# EAGLE design Retro_Programmer-v0.2 (EAGLE 7.3.0)
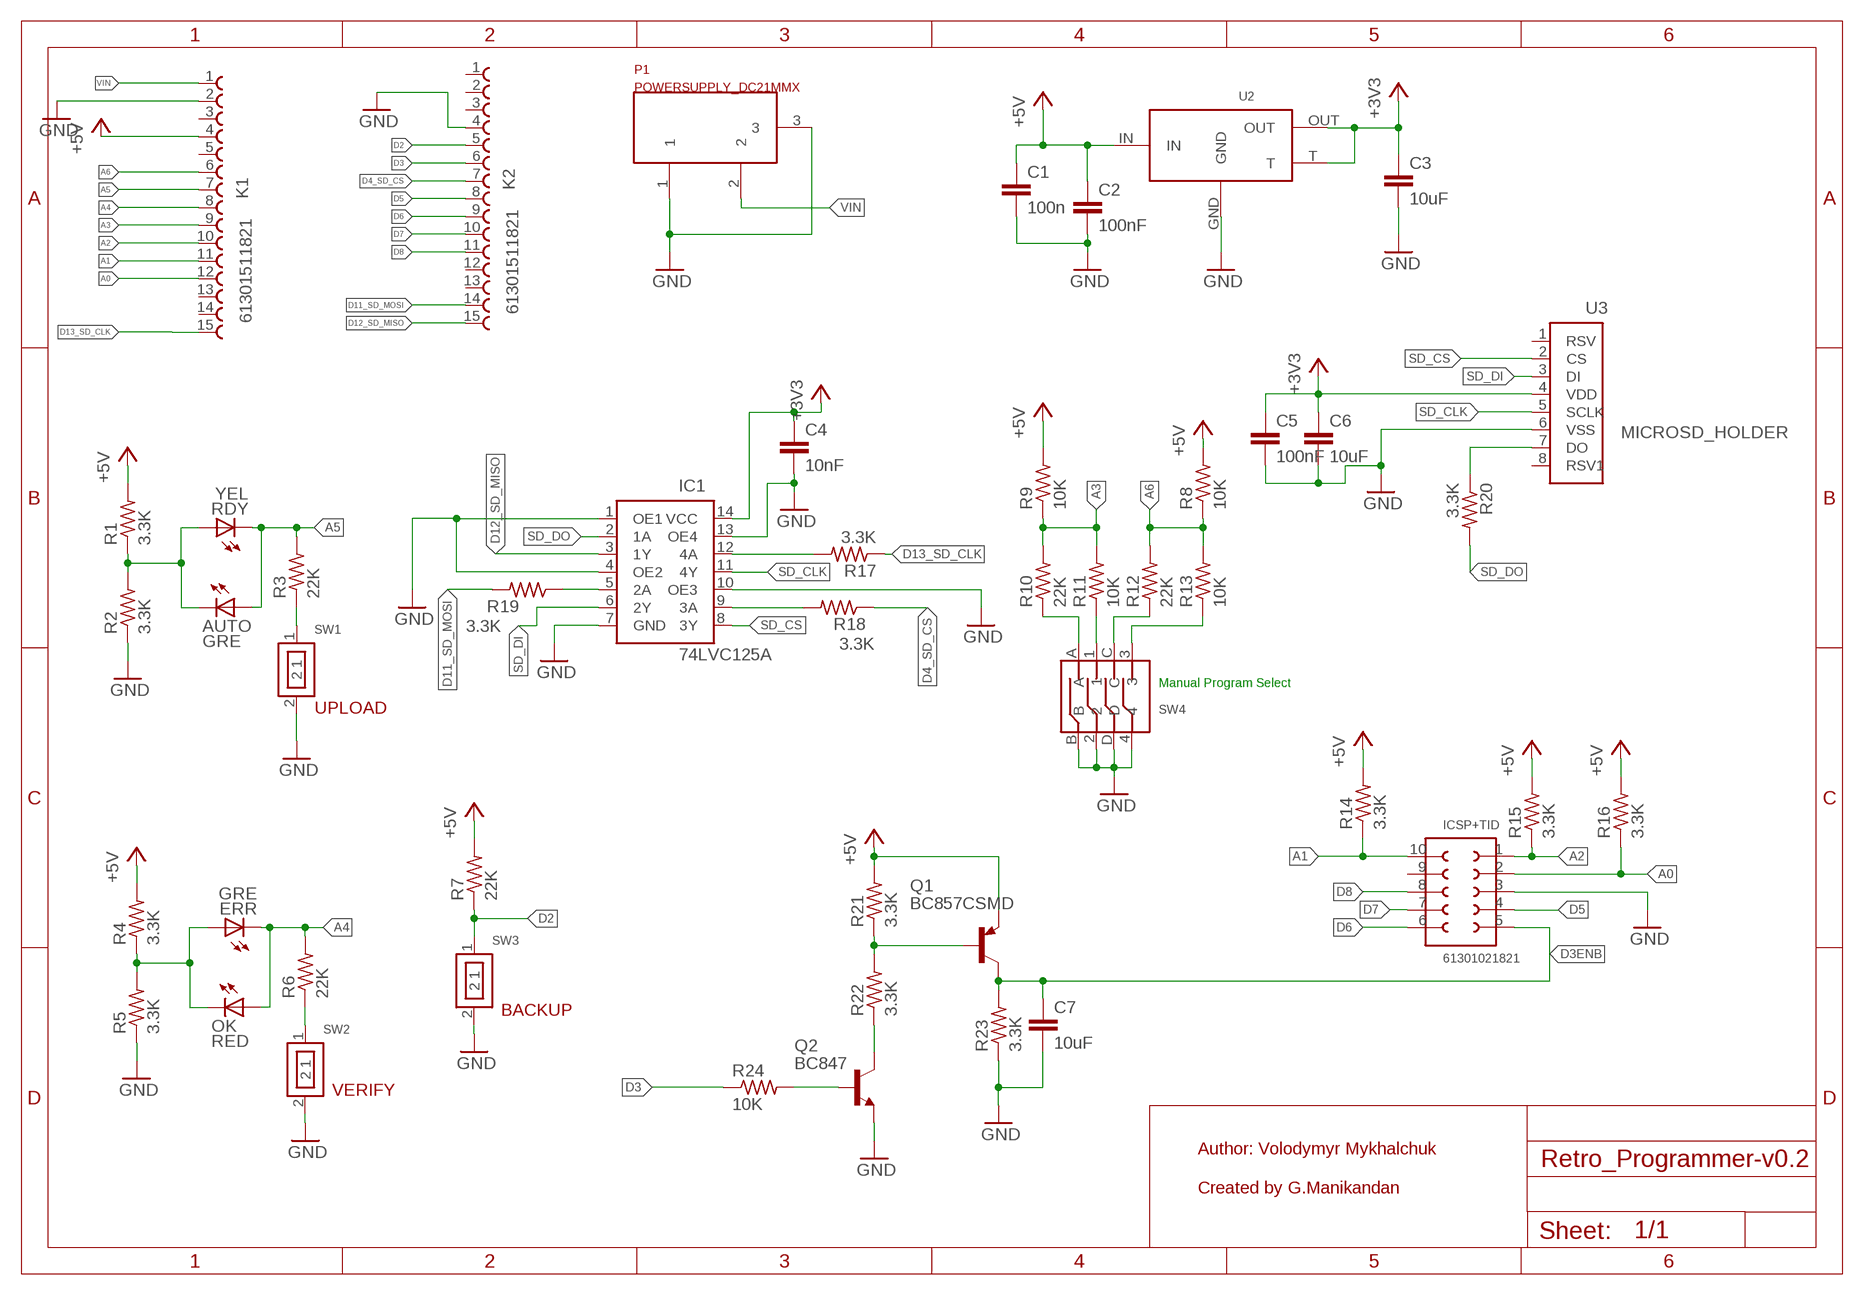
[diagram p0: schematic, sheet 1]

## Parts
AUTO  GRE  LEDCHIPLED_1206  [CHIPLED_1206]
C1  100n  C-EUC1206  [C1206]
C2  100nF  C-EUC1206  [C1206]
C3  10uF  C-EUC1206  [C1206]
C4  10nF  C-EUC1206  [C1206]
C5  100nF  C-EUC1206  [C1206]
C6  10uF  C-EUC1206  [C1206]
C7  10uF  C-EUC1206  [C1206]
ERR  GRE  LEDCHIPLED_1206  [CHIPLED_1206]
IC1  74LVC125A  [SOIC14_74L]
ICSP+TID  61301021821  [61301021821]
K1  61301511821  [61301511821]
K2  61301511821  [61301511821]
OK  RED  LEDCHIPLED_1206  [CHIPLED_1206]
P1  POWERSUPPLY_DC21MMX  [POWERSUPPLY_DC-21MM]
Q1  BC857CSMD  [SOT23-BEC]
Q2  BC847  [SOT23]
R1  3.3K  R-US_R1206  [R1206]
R2  3.3K  R-US_R1206  [R1206]
R3  22K  R-US_R1206  [R1206]
R4  3.3K  R-US_R1206  [R1206]
R5  3.3K  R-US_R1206  [R1206]
R6  22K  R-US_R1206  [R1206]
R7  22K  R-US_R1206  [R1206]
R8  10K  R-US_R1206  [R1206]
R9  10K  R-US_R1206  [R1206]
R10  22K  R-US_R1206  [R1206]
R11  10K  R-US_R1206  [R1206]
R12  22K  R-US_R1206  [R1206]
R13  10K  R-US_R1206  [R1206]
R14  3.3K  R-US_R1206  [R1206]
R15  3.3K  R-US_R1206  [R1206]
R16  3.3K  R-US_R1206  [R1206]
R17  3.3K  R-US_R1206  [R1206]
R18  3.3K  R-US_R1206  [R1206]
R19  3.3K  R-US_R1206  [R1206]
R20  3.3K  R-US_R1206  [R1206]
R21  3.3K  R-US_R1206  [R1206]
R22  3.3K  R-US_R1206  [R1206]
R23  3.3K  R-US_R1206  [R1206]
R24  10K  R-US_R1206  [R1206]
RDY  YEL  LEDCHIPLED_1206  [CHIPLED_1206]
SW1  SPUSH  [SLIDE1]
SW2  SPUSH  [SLIDE1]
SW3  SPUSH  [SLIDE1]
SW4  SLIDE_WAY4  [SLIDESWITCH_4]
U2  LT1117  [SOT223]
U3  MICROSD_HOLDER  [SDCARD_HOLDER]

## Nets
+3V3: C3.1 C4.1 C5.1 C6.1 IC1.14(VCC) U2.OUT U2.T U3.4(VDD)
+5V: C1.1 C2.1 K1.4 Q1.E R1.2 R4.2 R7.2 R8.2 R9.2 R14.2 R15.2 R16.2 R21.2 U2.IN
A0: ICSP+TID.2 K1.12 R16.1
A1: ICSP+TID.10 K1.11 R14.1
A2: ICSP+TID.1 K1.10 R15.1
A3: K1.9 R9.1 R10.2 R11.2
A4: ERR.C K1.8 OK.A R6.2
A5: AUTO.A K1.7 R3.2 RDY.C
A6: K1.6 R8.1 R12.2 R13.2
D2: K2.5 R7.1 SW3.1
D3: K2.6 R24.1
D3ENB: C7.1 ICSP+TID.5 Q1.C R23.2
D4_SD_CS: K2.7 R18.1
D5: ICSP+TID.4 K2.8
D6: ICSP+TID.6 K2.9
D7: ICSP+TID.7 K2.10
D8: ICSP+TID.8 K2.11
D11_SD_MOSI: K2.14 R19.2
D12_SD_MISO: IC1.3(1Y) K2.15
D13_SD_CLK: K1.15 R17.1
GND: C1.2 C2.2 C3.2 C4.2 C5.2 C6.2 C7.2 IC1.1(OE1) IC1.4(OE2) IC1.7(GND) IC1.10(OE3) IC1.13(OE4) ICSP+TID.3 K1.2 K2.4 P1.1 P1.3 Q2.2(E) R2.1 R5.1 R23.1 SW1.2 SW2.2 SW3.2 SW4.2 SW4.4 SW4.B SW4.D U2.GND U3.6(VSS)
N$1: AUTO.C R1.1 R2.2 RDY.A
N$2: R3.1 SW1.1
N$3: ERR.A OK.C R4.1 R5.2
N$4: R6.1 SW2.1
N$5: R10.1 SW4.A
N$6: R11.1 SW4.1
N$7: R12.1 SW4.C
N$8: R13.1 SW4.3
N$9: Q1.B R21.1 R22.2
N$10: R20.1 U3.7(DO)
N$11: Q2.3(C) R22.1
N$12: IC1.12(4A) R17.2
N$13: IC1.9(3A) R18.2
N$15: Q2.1(B) R24.2
N$17: IC1.5(2A) R19.1
SD_CLK: IC1.11(4Y) U3.5(SCLK)
SD_CS: IC1.8(3Y) U3.2(CS)
SD_DI: IC1.6(2Y) U3.3(DI)
SD_DO: IC1.2(1A) R20.2
VIN: K1.1 P1.2
Unconnected: ICSP+TID.9 K1.3 K1.5 K1.13 K1.14 K2.1 K2.2 K2.3 K2.12 K2.13 U3.1(RSV) U3.8(RSV1)

## Notes on the sheet
- U2
- Manual Program Select
- UPLOAD
- BACKUP
- VERIFY
- Author: Volodymyr Mykhalchuk
- Created by G.Manikandan

## Library data of the parts
AUTO ERR OK RDY = led:LED: LED OSRAM: - CHIPLED LG R971, LG N971, LY N971, LG Q971, LY Q971, LO R971, LY R971 LH N974, LH R974 LS Q976, LO Q976, LY Q976 LO Q996 - Hyper CHIPLED LW Q18S LB Q993, LB Q99A, LB R99A - SideLED LS A670, LO A670, LY A670, LG A670, LP A670 LB A673, LV A673, LT A673, LW A673 LH A674 LY A675 LS A676, LA A676, LO A676, LY A676, LW A676 LS A679, LY A679, LG A679 - Hyper Micro SIDELED® LS Y876, LA Y876, LO Y876, LY Y876 LT Y87S - SmartLED LW L88C, LW L88S LB L89C, LB L89S, LG L890 LS L89K, LO L89K, LY L89K LS L896, LA L896, LO L896, LY L896 - TOPLED LS T670, LO T670, LY T670, LG T670, LP T670 LSG T670, LSP T670, LSY T670, LOP T670, LYG T670 LG T671, LOG T671, LSG T671 LB T673, LV T673, LT T673, LW T673 LH T674 LS T676, LA T676, LO T676, LY T676, LB T676, LH T676, LSB T676, LW T676 LB T67C, LV T67C, LT T67C, LS T67K, LO T67K, LY T67K, LW E67C LS E67B, LA E67B, LO E67B, LY E67B, LB E67C, LV E67C, LT E67C LW T67C LS T679, LY T679, LG T679 LS T770, LO T770, LY T770, LG T770, LP T770 LB T773, LV T773, LT T773, LW T773 LH T774 LS E675, LA E675, LY E675, LS T675 LS T776, LA T776, LO T776, LY T776, LB T776 LHGB T686 LT T68C, LB T68C - Hyper Mini TOPLED® LB M676 - Mini TOPLED Santana® LG M470 LS M47K, LO M47K, LY M47K Source: http://www.osram.convergy.de LUXEON: - LUMILED® LXK2-PW12-R00, LXK2-PW12-S00, LXK2-PW14-U00, LXK2-PW14-V00 LXK2-PM12-R00, LXK2-PM12-S00, LXK2-PM14-U00 LXK2-PE12-Q00, LXK2-PE12-R00, LXK2-PE12-S00, LXK2-PE14-T00, LXK2-PE14-U00 LXK2-PB12-K00, LXK2-PB12-L00, LXK2-PB12-M00, LXK2-PB14-N00, LXK2-PB14-P00, LXK2-PB14-Q00 LXK2-PR12-L00, LXK2-PR12-M00, LXK2-PR14-Q00, LXK2-PR14-R00 LXK2-PD12-Q00, LXK2-PD12-R00, LXK2-PD12-S00 LXK2-PH12-R00, LXK2-PH12-S00 LXK2-PL12-P00, LXK2-PL12-Q00, LXK2-PL12-R00 Source: www.luxeon.com KINGBRIGHT: KA-3528ASYC Source: www.kingbright.com
C1-C7 = rcl:C-EU: CAPACITOR, European symbol
IC1 = Ard:74LVC125A
ICSP+TID = Wuerth_Elektronik_Board_to_Board:61301021821: WR-PHD 2.54mm Dual Socket Header, 10 Pins =>Code : Con_BTB_SHD_2.54_2_61301021821 <http://katalog.we-online.de/media/images/eican/Con_BTB_SHD_2.54_2_6130xx21821_pf2.jpg> Details see: http://katalog.we-online.de/en/em/613_0xx_218_21 Created 2014-05-29, Karrer Zheng 2014 (C) Würth Elektronik
K1 K2 = Wurth_Elektronik_Electromechanic_Board_to_Board_Connectors_rev15c:61301511821: WR-PHD 2.54mm Socket Header, 15 Pins =>Code : Con_BTB_SHD_2.54_1_THT_61301511821 <http://katalog.we-online.de/media/images/eican/Con_BTB_SHD_2.54_1_THT_6130xx11821_pf2.jpg> Details see: http://katalog.we-online.de/en/em/613_0xx_118_21 Created 2014-05-29, Karrer Zheng 2014 (C) Würth Elektronik
P1 = SmartPrj:POWERSUPPLY_DC21MM
Q1 = transistor-pnp:BC857*: PNP Transistror
Q2 = transistor:BC847: NPN TRANSISTOR
R1-R24 = rcl:R-US_: RESISTOR, American symbol
SW1-SW3 = Ard:SPUSH
SW4 = Ard:SLIDE_WAY4
U2 = linear-technology:LT1117
U3 = Ard:MICROSD_HOLDER

## Board
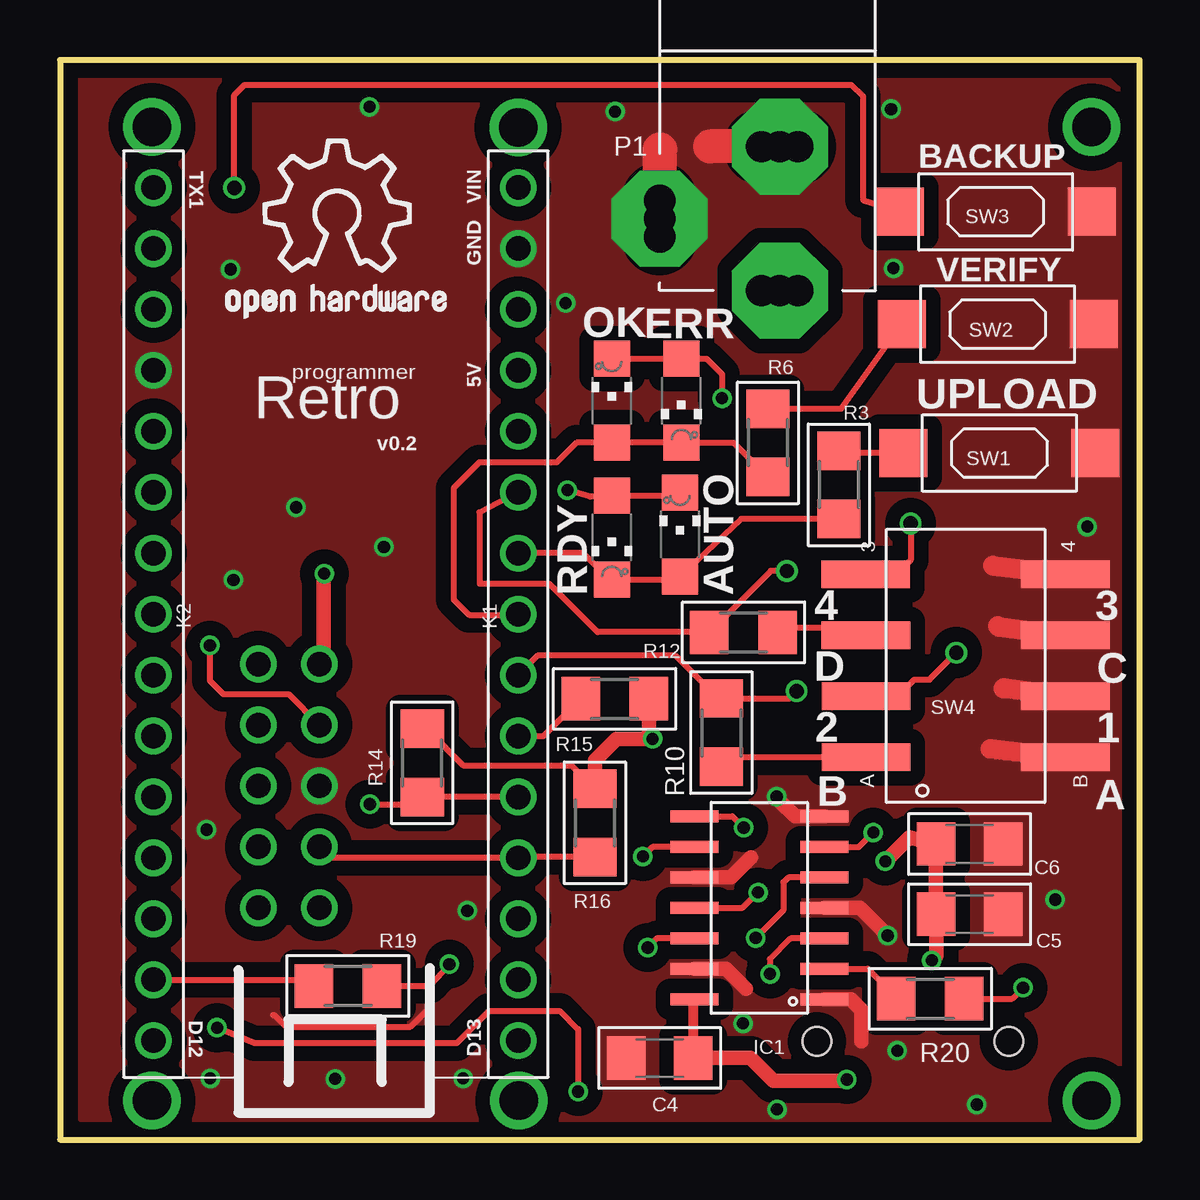
[diagram p1: board, top side]
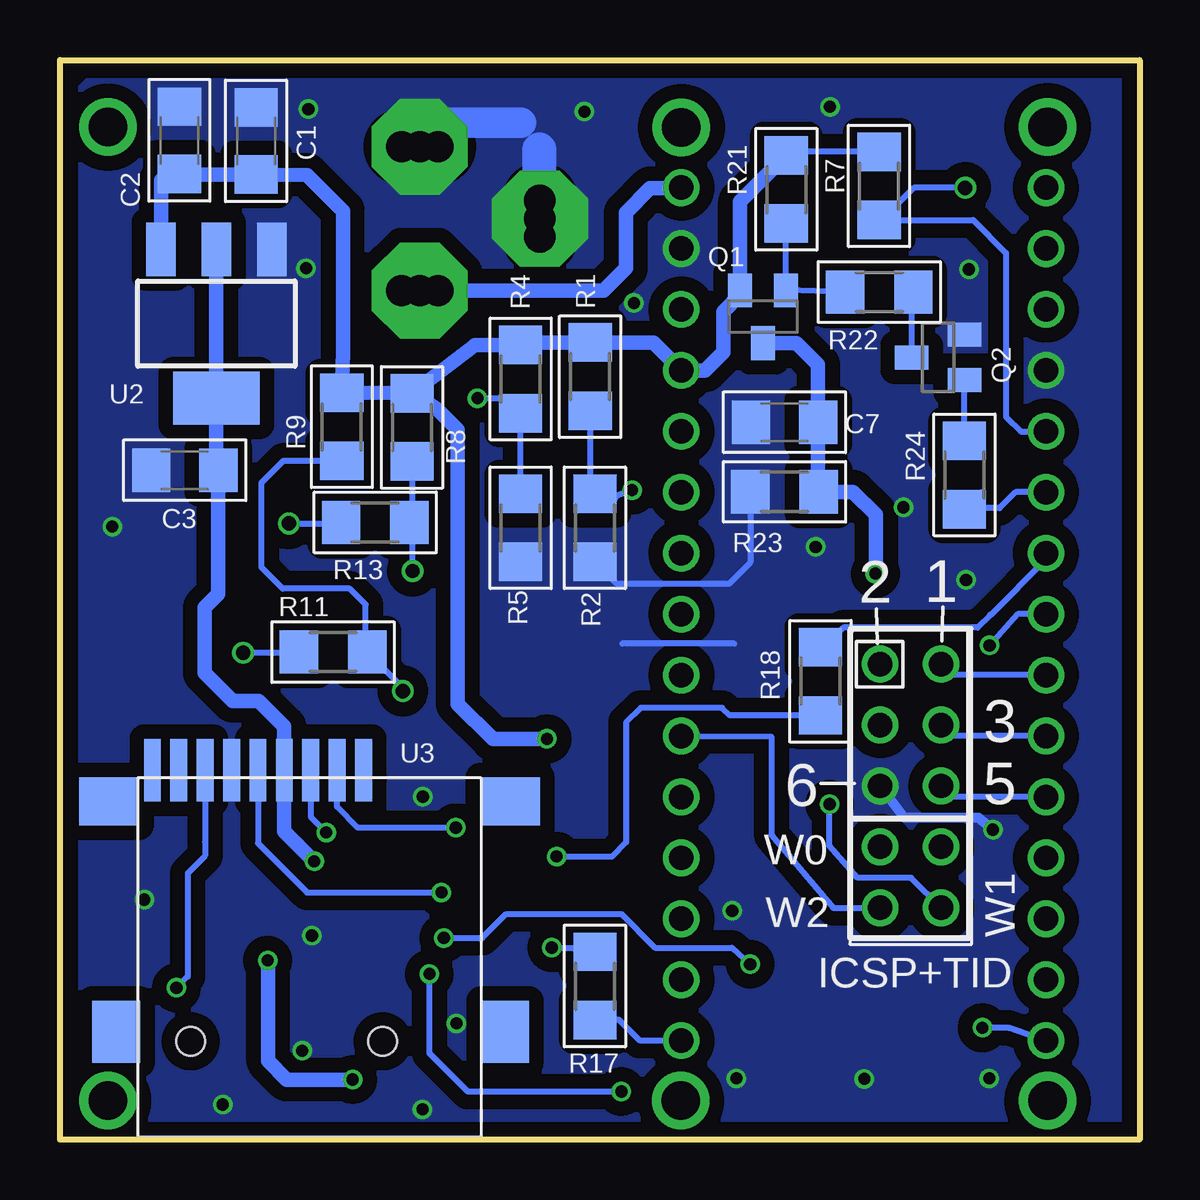
[diagram p2: board, bottom side, seen from below]

Size 45 x 45 mm. Coordinates in mm from the lower left corner, seen from the top.
Outline: 0,0 45,0 45,45 0,45 0,0
Copper layers (1*16): Top 0.035mm / dielectric 1.5mm / Bottom 0.035mm
Design rules "dirt_cheap_dirty_boards.v1": minimum track width 5mil, minimum drill 12mil, track to track 5mil, track to pad 5mil, pad to pad 5mil, via to via 5mil, smd to smd 0mil, copper to edge 10mil, drill to drill 10mil, minimum pad ring 10mil, minimum via ring 6mil, stop-mask expansion 2mil, vias tented up to drill 25mil, thermal gap 10mil

### Footprints (pad centres in the part's own frame; a part is rotated, then mirrored left to right if it is on the bottom)
CHIPLED_1206 = smd 1.5 x 1.5: A 0,-1.75; C 0,1.75
C1206 = smd 1.6 x 1.8: 1 -1.4,0; 2 1.4,0
SOIC14_74L = smd 2 x 0.5: 1 -2.7,3.81; 2 -2.7,2.54; 3 -2.7,1.27; 4 -2.7,0; 5 -2.7,-1.27; 6 -2.7,-2.54; 7 -2.7,-3.81; 8 2.7,-3.82; 9 2.7,-2.54; 10 2.7,-1.27; 11 2.7,0; 12 2.7,1.27; 13 2.7,2.54; 14 2.7,3.81
61301021821 = drill 1.02: 1 -5.08,1.27; 2 -2.54,1.27; 3 0,1.27; 4 2.54,1.27; 5 5.08,1.27; 6 5.08,-1.27; 7 2.54,-1.27; 8 0,-1.27; 9 -2.54,-1.27; 10 -5.08,-1.27
61301511821 = drill 1.02: 1 -17.78,0; 2 -15.24,0; 3 -12.7,0; 4 -10.16,0; 5 -7.62,0; 6 -5.08,0; 7 -2.54,0; 8 0,0; 9 2.54,0; 10 5.08,0; 11 7.62,0; 12 10.16,0; 13 12.7,0; 14 15.24,0; 15 17.78,0
POWERSUPPLY_DC-21MM = drill 1.3 pad 4 octagon: 1 -5.08,-3.353; 2 -0.076,-6.35; 3 -0.076,-0.356 | drill 1.3: 4 -5.08,-4.115; 5 -5.08,-2.591; 6 -0.838,-0.356; 7 0.686,-0.356; 8 -0.838,-6.35; 9 0.686,-6.35
SOT23-BEC = smd 1 x 1.4: B -0.95,-1.1; C 0,1.1; E 0.95,-1.1
SOT23 = smd 1 x 1.4: 1 -0.95,-1.1; 2 0.95,-1.1; 3 0,1.1
R1206 = smd 1.6 x 1.803: 1 -1.422,0; 2 1.422,0
SLIDE1 = smd 2 x 2: 1 0,4; 2 0,-4
SLIDESWITCH_4 = smd 1.15 x 3.7: 1 -1.27,4.15; 2 -1.27,-4.15; 3 3.81,4.17; 4 3.81,-4.15; A -3.81,4.15; B -3.81,-4.16; C 1.27,4.16; D 1.27,-4.16
SOT223 = smd 1.219 x 2.235: GND -2.311,-3.099; IN 2.311,-3.099; OUT 0,-3.099 | smd 3.6 x 2.2: T 0,3.099
SDCARD_HOLDER = smd 0.7 x 2.6: 1 3.2,7.8; 2 2.1,7.8; 3 1,7.8; 4 -0.1,7.8; 5 -1.2,7.8; 6 -2.3,7.8; 7 -3.4,7.8; 8 -4.5,7.8; 9 -5.6,7.8 | smd 2 x 2.6: P$1 -7.1,-3.1; P$2 9.1,-3.1 | smd 2.5 x 2: P$3 -7.4,6.5; P$4 9.3,6.5 | hole 1.2: -4,-3.5; 4,-3.5

### Placement (x,y rotation side)
AUTO  25.84,25.23 0 top
C1  36.83,41.63 90 bottom
C2  40.02,41.65 90 bottom
C3  39.8,27.9 180 bottom
C4  25,3.4 180 top
C5  37.92,9.39 0 top
C6  37.92,12.32 0 top
C7  14.8,29.9 180 bottom
ERR  25.9,30.8 180 top
IC1  29.16,9.66 180 top
ICSP+TID  9.54,14.74 90 bottom
K1  19.1,21.9 270 top
K2  3.9,21.9 270 top
OK  23,30.8 0 top
P1  30.08,41.74 0 top
Q1  15.7,34.3 180 bottom
Q2  8.4,32.6 90 bottom
R1  22.9,31.8 90 bottom
R2  22.7,25.5 90 bottom
R3  32.47,27.29 270 top
R4  25.8,31.7 90 bottom
R5  25.8,25.5 90 bottom
R6  29.51,29.04 270 top
R7  10.86,39.75 90 bottom
R8  30.32,29.69 90 bottom
R9  33.25,29.71 90 bottom
R10  27.57,16.96 90 top
R11  33.62,20.32 0 bottom
R12  28.49,21.14 180 top
R13  31.86,25.72 0 bottom
R14  15.1,15.7 90 top
R15  23.12,18.37 0 top
R16  22.3,13.2 90 top
R17  22.7,6.4 90 bottom
R18  13.3,19.1 270 bottom
R19  12,6.4 180 top
R20  36.27,5.87 180 top
R21  14.73,39.61 90 bottom
R22  10.85,35.32 180 bottom
R23  14.8,27 0 bottom
R24  7.3,27.7 90 bottom
RDY  23,25.1 180 top
SW1  39.16,28.61 90 top
SW2  39.08,33.99 90 top
SW3  39.01,38.67 90 top
SW4  37.75,19.74 90 top
U2  38.48,34.01 180 bottom
U3  35.55,7.59 0 bottom

### Tracks (layer width: path | path; a pad name or v marks a point on that pad's centre or on a via)
115  (via drill 1.6)
  other vias: 19.13,1.62
+3V3  (via drill 0.51)
  Top 0.406: IC1.14 26.4,5.79 C4.1
  Top 0.61: v34.4,11.6 35.4,12.6 C6.1 C5.1 36.54,7.67 v36.34,7.47 | C4.1 28.78,3.4 29.74,2.44 32.74,2.44 v32.8,2.5
  Bottom 0.254: U2.T 38.48,30.48 38.4,30.4 38.4,30.83 U2.T
  Bottom 0.61: U2.OUT U2.T 38.48,27.98 C3.1 38.4,22.74 38.96,22.17 38.96,19.46 37.8,18.29 36.73,18.29 35.65,17.21 U3.4 35.65,12.85 v34.4,11.6 | v32.8,2.5 35.55,2.5 36.32,3.28 36.32,7.45 v36.34,7.47
+5V  (via drill 0.51)
  Top 0.254: R14.2 15.28,17.12 15.28,17.02 15.38,17.02 16.8,15.6 21.32,15.6 R16.2
  Top 0.61: 24.72,16.72 v24.7,16.7 | R16.2 22.3,15.8 23.19,16.69 24.69,16.69 v24.7,16.7 | R15.2 24.54,16.86 v24.7,16.7
  Bottom 0.254: 40.7,37.02 U2.IN | R7.2 14.58,41.17 R21.2
  Bottom 0.61: R8.2 27.7,33.12 R4.2 25.7,33.22 R1.2 20.26,33.22 K1.4 18.11,32.06 17.35,32.82 17.35,34.52 16.65,35.22 Q1.E 16.65,39.1 R21.2 | R8.2 R9.2 33.2,32.8 33.2,38.7 34.7,40.2 C1.1 40.5,40.23 C2.1 40.79,39.99 U2.IN | R8.2 29.25,30.42 28.42,29.59 28.42,18.16 26.95,16.69 24.71,16.69 v24.7,16.7 24.74,16.66
A0
  Top 0.254: R16.1 19.14,11.78 K1.12 11.27,11.74 ICSP+TID.2
A1  (via drill 0.51)
  Top 0.254: v12.92,13.98 14.8,13.98 R14.1 K1.11
  Bottom 0.254: ICSP+TID.10 9.53,10.91 11.75,10.91 12.93,12.24 v12.92,13.98
A2
  Top 0.254: K1.10 20.15,16.82 R15.1
  Bottom 0.254: K1.10 15.35,16.8 15.35,12.71 12.75,9.65 ICSP+TID.1
A3  (via drill 0.6)
  Top 0.254: v30.71,18.69 30.4,18.38 R10.2 27.44,18.38 25.65,20.17 19.91,20.17 K1.9
  Bottom 0.254: v30.71,18.69 30.71,18.83 R11.2 32.26,20.38 32.26,22.3 32.92,22.96 35.71,22.96 36.6,23.85 36.6,27.38 35.69,28.3 R9.1
A4
  Top 0.254: R6.2 28.08,29.05 ERR.C OK.A 21.53,29.05 20.7,28.22 17.48,28.22 16.41,27.15 16.41,22.5 17.04,21.87 19.07,21.87 K1.8
A5
  Top 0.254: R3.2 28.39,25.87 AUTO.A 25.87,23.35 RDY.C 22.95,23.3 21.81,24.44 K1.7
A6  (via drill 0.6)
  Top 0.254: K1.6 17.48,26.14 17.5,26.11 17.5,23.16 20.4,23.16 22.41,21.15 27.04,21.15 R12.2 29.63,23.7 v30.3,23.7
  Bottom 0.254: R8.1 30.32,25.48 R13.2 30.3,25.59 v30.3,23.7
D2  (via drill 0.6)
  Top 0.254: v7.26,39.67 7.26,43.54 7.7,43.97 32.97,43.97 33.48,43.48 33.48,39.16 SW3.1
  Bottom 0.254: R7.1 6.93,38.33 5.56,36.96 5.56,30.12 4.95,29.52 K2.5 | R7.1 10.11,38.33 | v7.26,39.67 9.4,39.67 10.24,38.84 10.35,38.84 R7.1
D3
  Bottom 0.254: 6.6,26.98 6.9,26.68 | 6.9,26.68 R24.1 | K2.6 5.18,26.98 5.84,26.31 6.53,26.31 6.9,26.68
D3ENB  (via drill 0.51)
  Top 0.254: 11,23.57 v11.02,23.59
  Top 0.61: 11,23.57 11,20.01 ICSP+TID.5
  Bottom 0.254: 13.4,27.02 R23.2 | 11,23.61 v11.02,23.59
  Bottom 0.61: Q1.C 14.3,33.2 13.4,32.3 C7.1 13.4,27.02 | R23.2 11.94,27 11,26.06 11,23.61
D4_SD_CS
  Bottom 0.254: R18.1 12.79,21.03 12.65,21.03 12.34,21.34 6.76,21.34 6.22,21.87 6.2,21.87 3.9,24.17 K2.7
D5  (via drill 0.51)
  Top 0.254: v6.25,20.6 6.25,19.13 6.81,18.57 9.52,18.57 ICSP+TID.4
  Bottom 0.254: v6.25,20.6 5.08,21.9 K2.8
D6
  Bottom 0.254: K2.9 7.81,19.36 ICSP+TID.6
D7
  Bottom 0.254: K2.10 7.81,16.82 ICSP+TID.7
D8
  Bottom 0.254: K2.11 7.81,14.28 ICSP+TID.8
D11_SD_MOSI
  Top 0.254: K2.14 10.31,6.66 R19.2
D12_SD_MISO  (via drill 0.51)
  Top 0.254: v21.6,2 21.6,4.6 20.84,5.36 17.88,5.36 16.54,4.01 8.11,4.01 v6.55,4.66 | IC1.3 30.45,8.38 29.59,7.52 v29.59,6.91 v29.6,6.9
  Bottom 0.254: v21.6,2 28,2 29.6,3.6 v29.6,6.9 | K2.15 5.44,4.65 v6.55,4.66
D13_SD_CLK
  Bottom 0.254: R17.1 22.68,5 21.7,5 20.82,4.12 K1.15
GND  (via drill 0.51)
  Top 0.254: 8.87,5.18 8.94,5.18 9.42,4.7 14.61,4.7 15.21,5.31
  Top 0.61: IC1.7 30.65,13.47 30,14.12 | IC1.10 27.97,10.93 28.8,11.76 | IC1.4 33.34,9.66 v34.5,8.5 | IC1.13 27.76,7.12 28.6,6.27 | IC1.1 32.97,5.85 33.4,5.41 33.4,4.09
  Top 0.813: SW4.B 38.79,16.29 38.79,16.28 | SW4.2 39.35,18.83 39.32,18.8 | SW4.D 39.13,21.37 39.09,21.41 | SW4.4 38.9,23.91 38.89,23.93
  Top 1.422: 25.02,41.27 24.99,41.27 24.99,38.61 | 30.12,41.4 27.1,41.4
  Bottom 0.254: R23.1 16.22,24.06 17.12,23.16 21.79,23.16 R2.1 | 16.89,20.68 21.57,20.68
  Bottom 0.406: v6.11,12.91 6.71,13.41 9.8,13.41 ICSP+TID.3
  Bottom 1.27: 25.78,42.39 28.68,42.39 29.49,41.58
  Bottom 1.422: 25.22,38.2 25.02,38.2 25.02,41.27
  other vias: 12.9,43.05 34.64,42.95 42.82,25.55 34.9,3.7 16.8,2.55 13.5,24.7 21.08,34.87 9.84,26.35 28.47,4.84 41.48,10 11.47,2.53 6.26,2.55 7.23,23.33 16.98,9.54 29.89,1.26 38.22,1.46 29.88,14.29 23.14,42.85 34.74,36.32 7.11,36.27
  pour Bottom (isolate 0.61, no thermals): 1.2,44.5 43.5,44.5 44.5,43.5 44.5,1.6 43.4,0.5 1.1,0.5 0.5,1.1 0.5,44.1 0.9,44.5 1.1,44.5
  pour Top (isolate 0.61, no thermals): 0.81,44.25 43.64,44.25 44.42,43.46 44.42,1.14 43.79,0.51 1.22,0.51 0.46,1.27 0.46,43.94 0.76,44.25
N$1  (via drill 0.51)
  Top 0.254: AUTO.C 26.2,26.85 RDY.A 22.95,26.8 22.1,26.8 v21.15,27.07
  Bottom 0.254: R1.1 22.9,27.12 | 22.9,27.12 R2.2 22.17,26.39 22.02,26.39 21.81,26.82 v21.15,27.07 | 22.9,27.12 22.62,27.12
N$2
  Top 0.254: SW1.1 32.57,28.61 R3.1
N$3  (via drill 0.51)
  Top 0.254: OK.C ERR.A 26.95,32.55 27.6,31.9 v27.6,30.9
  Bottom 0.254: R5.2 R4.1 26.42,30.9 v27.6,30.9
N$4
  Top 0.254: R6.1 32.57,30.46 SW2.1
N$5
  Top 0.254: SW4.A 27.96,15.93 R10.1
N$6  (via drill 0.6)
  Top 0.254: SW4.1 34.91,18.47 35.61,19.18 36.25,19.18 v37.36,20.3
  Bottom 0.254: v37.36,20.3 35.07,20.3 R11.1
N$7
  Top 0.254: SW4.C 33.74,21.32 30.36,21.32 R12.1
N$8  (via drill 0.6)
  Top 0.254: v35.46,25.68 35.46,24.16 35.13,23.82 33.85,23.82 SW4.3
  Bottom 0.254: v35.46,25.68 33.32,25.68 R13.1
N$9
  Bottom 0.254: R21.1 14.75,37.73 Q1.B R22.2
N$10  (via drill 0.51)
  Top 0.254: 37.92,6.22 37.92,5.9 R20.1 39.69,5.87 v40.14,6.32
  Bottom 0.254: U3.7 38.95,12.41 38.95,11.82 39.67,11.1 39.67,6.79 v40.14,6.32
N$11
  Bottom 0.254: Q2.3 9.5,35.38 R22.1
N$12  (via drill 0.51)
  Top 0.254: IC1.12 24.89,8.39 v24.5,8
  Bottom 0.254: v24.5,8 22.88,8 R17.2
N$13  (via drill 0.51)
  Top 0.254: IC1.9 24.7,12.2 v24.3,11.8
  Bottom 0.254: v24.3,11.8 23.9,11.8 22.1,11.8 22,11.8 21.4,12.4 21.4,17.4 20.8,18 17.4,18 17.08,17.68 R18.2
N$14  (via drill 1.6)
  other vias: 3.84,42.21
N$15
  Bottom 0.254: R24.2 Q2.1
N$16  (via drill 1.6)
  other vias: 19.1,42.19
N$17  (via drill 0.51)
  Top 0.254: IC1.5 30.36,10.93 30.15,10.72 30.15,9.55 v29,8.4 | R19.1 15.4,6.4 v16.23,7.31
  Bottom 0.254: v29,8.4 27.4,8.4 26.4,9.4 21.6,9.4 20.2,8 17,8 v16.23,7.31
N$18  (via drill 1.6)
  other vias: 3.84,1.62
N$19  (via drill 1.6)
  other vias: 43,42.2
N$20  (via drill 1.6)
  other vias: 43,1.62
SD_CLK  (via drill 0.51)
  Top 0.254: IC1.11 28.46,9.66 v29.1,10.3
  Bottom 0.254: v29.1,10.3 34.7,10.3 36.75,12.35 U3.5
SD_CS  (via drill 0.51)
  Top 0.254: IC1.8 28.02,13.48 v28.5,13
  Bottom 0.254: v28.5,13 32.58,13 33.45,13.87 U3.2
SD_DI  (via drill 0.51)
  Top 0.254: IC1.6 33.3,12.2 v33.9,12.8
  Bottom 0.254: U3.3 34.55,13.45 v33.9,12.8
SD_DO
  Top 0.254: R20.2 34.62,6.36 34.62,6.48 34.44,6.66 34.14,6.66 33.68,7.12 IC1.2
VIN
  Bottom 0.61: P1.2 22.35,35.39 21.41,36.32 21.41,38.63 20.4,39.65 19.13,39.65 K1.1

### Text on the board
tNames: BACKUP | TX1 | VIN | GND | VERIFY | programmer | 5V | Retro | UPLOAD | v0.2 | 4 | 3 | D | C | SW4 | 2 | 1 | B | A | D12 | D13
bNames: 1 | 2 | 3 | 5 | 6 | W0 | W1 | W2
200bmp: C:/Documents and Settings/user/Desktop/bmp.bmp